# Altium schematic sheet Ethernet.SchDoc
size 420 x 297 mm; Scale: 1:1; DocumentType: Схема электрическая принципиальная; FirstReferrence: АБВГ.123456.001
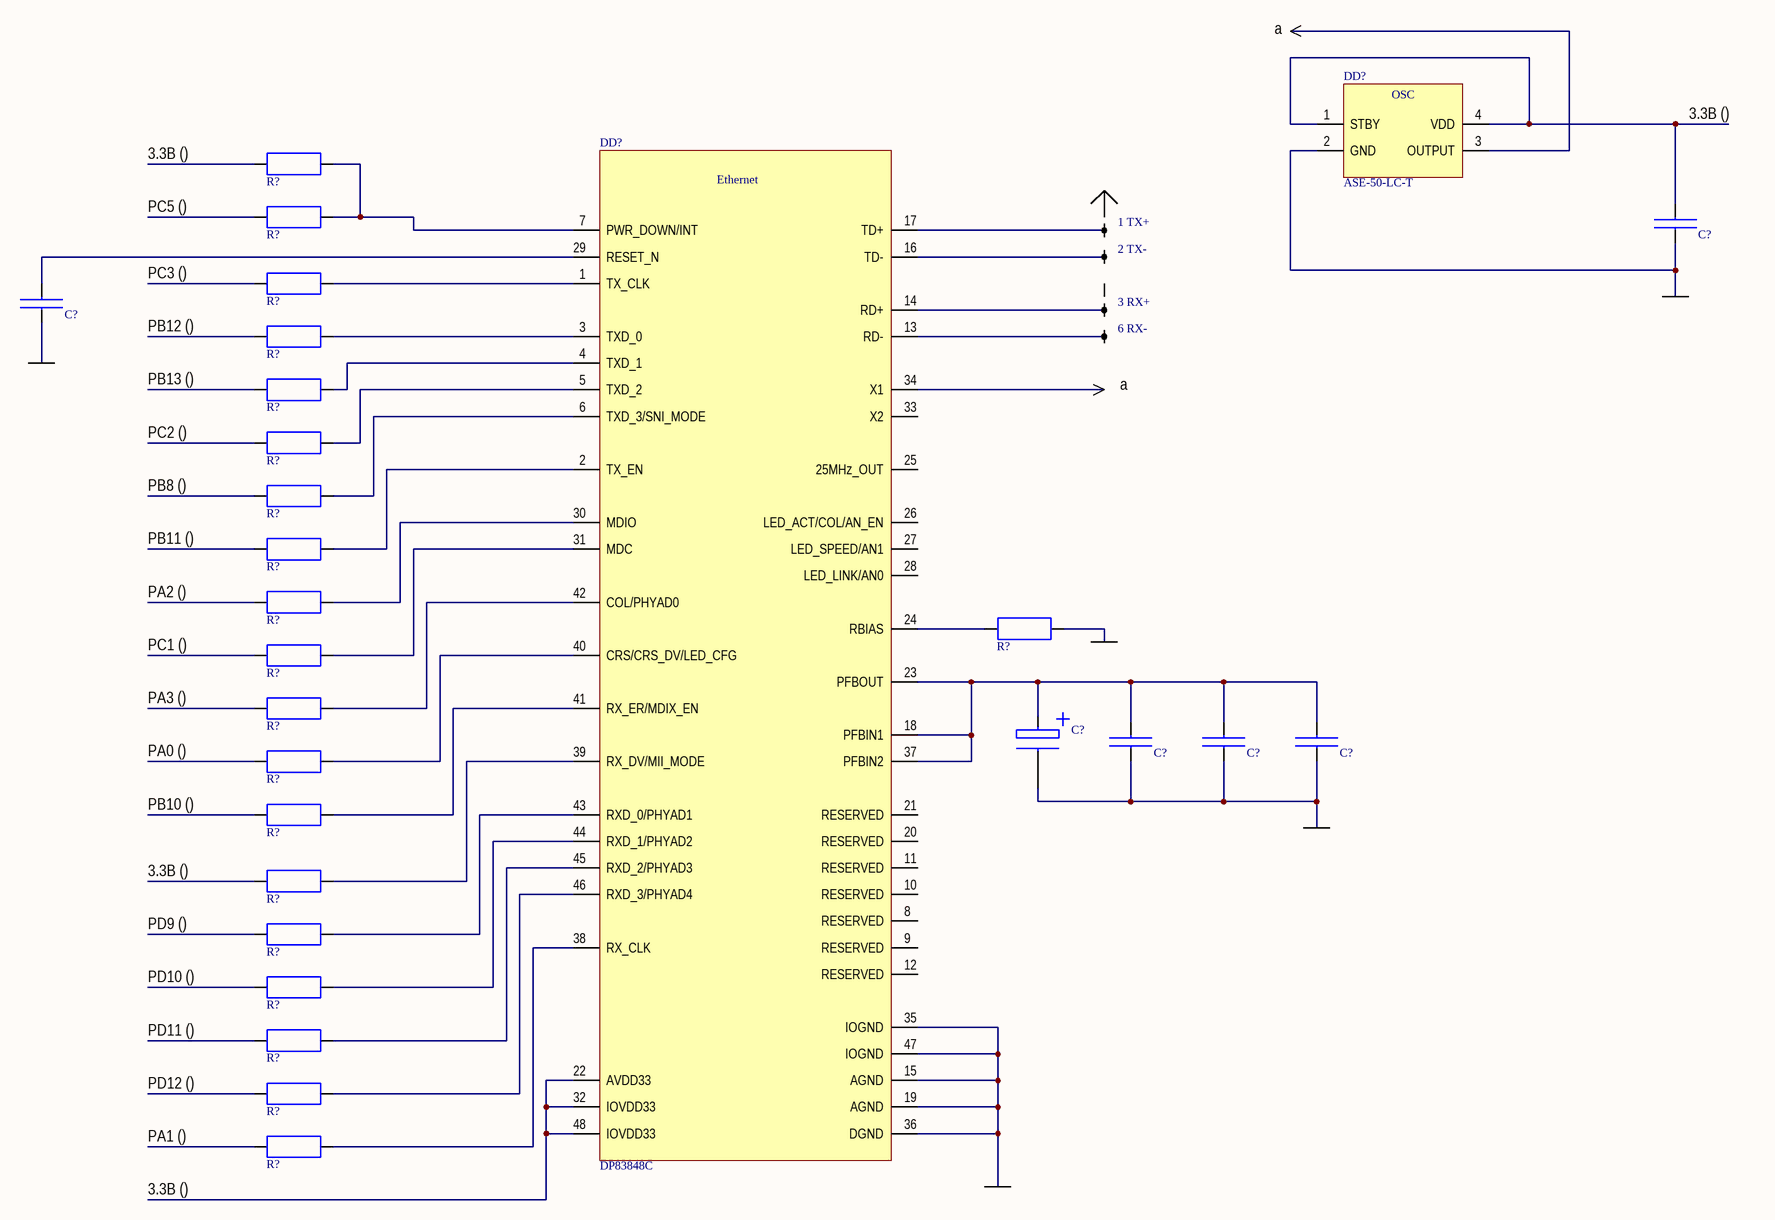
[diagram p0: Ethernet.SchDoc]

## Parts
(Parts that share a designator on the sheet are numbered #1, #2 ... from top to bottom, then left to right.)
C?#1  C_2  (value not drawn)
C?#2  C_2  (value not drawn)
C?#3  C_3  (value not drawn)
C?#4  C_2  (value not drawn)
C?#5  C_2  (value not drawn)
C?#6  C_2  (value not drawn)
DD?#1  ASE-50-LC-T  [ASE_OSC]
DD?#2  DP83848C  [VBH48A_N]
R?#1  R_1  (value not drawn)
R?#2  R_1  (value not drawn)
R?#3  R_1  (value not drawn)
R?#4  R_1  (value not drawn)
R?#5  R_1  (value not drawn)
R?#6  R_1  (value not drawn)
R?#7  R_1  (value not drawn)
R?#8  R_1  (value not drawn)
R?#9  R_1  (value not drawn)
R?#10  R_1  (value not drawn)
R?#11  R_1  (value not drawn)
R?#12  R_1  (value not drawn)
R?#13  R_1  (value not drawn)
R?#14  R_1  (value not drawn)
R?#15  R_1  (value not drawn)
R?#16  R_1  (value not drawn)
R?#17  R_1  (value not drawn)
R?#18  R_1  (value not drawn)
R?#19  R_1  (value not drawn)
R?#20  R_1  (value not drawn)
X?#1  1 TX+  [RJ45]  (part A of 7)
X?#2  2 TX-  [RJ45]  (part B of 7)
X?#3  3 RX+  [RJ45]  (part C of 7)
X?#4  6 RX-  [RJ45]  (part F of 7)

## Nets
NetC?#1_1: C?#1.1 DD?#1.2(GND)
NetC?#1_2: C?#1.2 DD?#1.1(STBY) DD?#1.4(VDD)
NetC?#2_2: C?#2.2 DD?#2.29(RESET_N)
NetC?#3_1: C?#3.1 C?#4.2 C?#5.2 C?#6.2 DD?#2.18(PFBIN1) DD?#2.23(PFBOUT) DD?#2.37(PFBIN2)
NetC?#4_1: C?#4.1 C?#5.1 C?#6.1
NetDD?#2_1: DD?#2.1(TX_CLK) R?#3.2
NetDD?#2_2: DD?#2.2(TX_EN) R?#8.2
NetDD?#2_3: DD?#2.3(TXD_0) R?#4.2
NetDD?#2_4: DD?#2.4(TXD_1) R?#5.2
NetDD?#2_5: DD?#2.5(TXD_2) R?#6.2
NetDD?#2_6: DD?#2.6(TXD_3/SNI_MODE) R?#7.2
NetDD?#2_7: DD?#2.7(PWR_DOWN/INT) R?#1.2 R?#2.2
NetDD?#2_13: DD?#2.13(RD-) X?#4.6
NetDD?#2_14: DD?#2.14(RD+) X?#3.3
NetDD?#2_15: DD?#2.15(AGND) DD?#2.19(AGND) DD?#2.35(IOGND) DD?#2.36(DGND) DD?#2.47(IOGND)
NetDD?#2_16: DD?#2.16(TD-) X?#2.2
NetDD?#2_17: DD?#2.17(TD+) X?#1.1
NetDD?#2_22: DD?#2.22(AVDD33) DD?#2.32(IOVDD33) DD?#2.48(IOVDD33)
NetDD?#2_24: DD?#2.24(RBIAS) R?#10.1
NetDD?#2_30: DD?#2.30(MDIO) R?#9.2
NetDD?#2_31: DD?#2.31(MDC) R?#11.2
NetDD?#2_38: DD?#2.38(RX_CLK) R?#20.2
NetDD?#2_39: DD?#2.39(RX_DV/MII_MODE) R?#15.2
NetDD?#2_40: DD?#2.40(CRS/CRS_DV/LED_CFG) R?#13.2
NetDD?#2_41: DD?#2.41(RX_ER/MDIX_EN) R?#14.2
NetDD?#2_42: DD?#2.42(COL/PHYAD0) R?#12.2
NetDD?#2_43: DD?#2.43(RXD_0/PHYAD1) R?#16.2
NetDD?#2_44: DD?#2.44(RXD_1/PHYAD2) R?#17.2
NetDD?#2_45: DD?#2.45(RXD_2/PHYAD3) R?#18.2
NetDD?#2_46: DD?#2.46(RXD_3/PHYAD4) R?#19.2

Not connected (* = marked no-connect by the designer): C?#2 1; C?#3 2; DD?#1 3(OUTPUT); DD?#2 8(RESERVED) 9(RESERVED) 10(RESERVED) 11(RESERVED) 12(RESERVED) 20(RESERVED) 21(RESERVED) 25(25MHz_OUT) 26(LED_ACT/COL/AN_EN) 27(LED_SPEED/AN1) 28(LED_LINK/AN0) 33(X2) 34(X1); R?#1 1; R?#2 1; R?#3 1; R?#4 1; R?#5 1; R?#6 1; R?#7 1; R?#8 1; R?#9 1; R?#10 2; R?#11 1; R?#12 1; R?#13 1; R?#14 1; R?#15 1; R?#16 1; R?#17 1; R?#18 1; R?#19 1; R?#20 1

## Notes on the sheet
- a
- 3.3В ()
- PC5 ()
- PC3 ()
- PB12 ()
- PB13 ()
- PC2 ()
- (near X?#4) a
- PB8 ()
- PB11 ()
- PA2 ()
- PC1 ()
- PA3 ()
- PA0 ()
- PB10 ()
- PD9 ()
- PD10 ()
- PD11 ()
- PD12 ()
- PA1 ()
- Подп. и дата
- Инв. № дубл.
- Взам. инв. №
- Инв. № подл.
- Изм.
- Лист
- № докум.
- Подп.
- Дата
- 2.106-A3
- Копировал
- Формат А3
- (in symbol ASE-50-LC-T) OSC
- (in symbol DP83848C) Ethernet

## Library data of the parts
X?#1-X?#4 = RJ45